# EAGLE design MessVerstaerker (EAGLE 6.2)
Messverstärker mit 4 Stufen 20, 0, -20, -40 dB
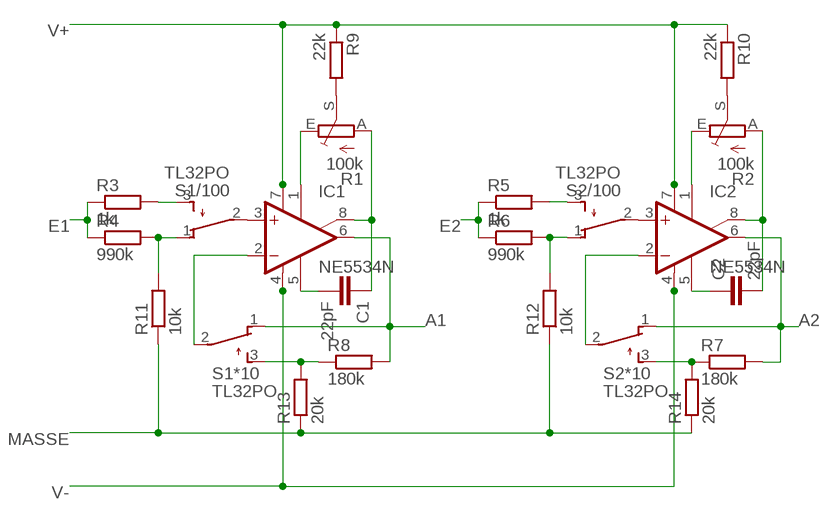
[diagram p0: schematic, sheet 1]

## Parts
C1  22pF  C2.5/2  [C2.5-2]
C2  22pF  C2.5/2  [C2.5-2]
IC1  NE5534N  [DIL08]
IC2  NE5534N  [DIL08]
R1  100k  TRIM_EU-B25V  [B25V]
R2  100k  TRIM_EU-B25V  [B25V]
R3  1k  R-EU_0309/10  [0309/10]
R4  990k  R-EU_0309/10  [0309/10]
R5  1k  R-EU_0309/10  [0309/10]
R6  990k  R-EU_0309/10  [0309/10]
R7  180k  R-EU_0309/10  [0309/10]
R8  180k  R-EU_0309/10  [0309/10]
R9  22k  R-EU_0309/10  [0309/10]
R10  22k  R-EU_0309/10  [0309/10]
R11  10k  R-EU_0309/10  [0309/10]
R12  10k  R-EU_0309/10  [0309/10]
R13  20k  R-EU_0309/10  [0309/10]
R14  20k  R-EU_0309/10  [0309/10]
S1*10  TL32PO  [TL3XPO]
S1/100  TL32PO  [TL3XPO]
S2*10  TL32PO  [TL3XPO]
S2/100  TL32PO  [TL3XPO]

## Nets
A1: IC1.6(OUT) R8.2 S1*10.1(O)
A2: IC2.6(OUT) R7.2 S2*10.1(O)
E1: R3.1 R4.1
E2: R5.1 R6.1
MASSE: R11.1 R12.1 R13.1 R14.1
N$1: R1.S R9.2
N$2: R2.S R10.2
N$3: IC2.1(ON) R2.E
N$4: C1.2 IC1.5(CMP)
N$5: C2.2 IC2.8(ON/CMP) R2.A
N$6: C1.1 IC1.8(ON/CMP) R1.A
N$7: IC1.1(ON) R1.E
N$8: C2.1 IC2.5(CMP)
N$10: R6.2 R12.2 S2/100.1(O)
N$11: R4.2 R11.2 S1/100.1(O)
N$12: IC1.3(+IN) S1/100.2(P)
N$13: R8.1 R13.2 S1*10.3(S)
N$14: R3.2 S1/100.3(S)
N$15: IC2.3(+IN) S2/100.2(P)
N$16: R7.1 R14.2 S2*10.3(S)
N$17: IC1.2(-IN) S1*10.2(P)
N$18: IC2.2(-IN) S2*10.2(P)
N$19: R5.2 S2/100.3(S)
V+: IC1.7(V+) IC2.7(V+) R9.1 R10.1
V-: IC1.4(V-) IC2.4(V-)

## Library data of the parts
C1 C2 = capacitor-wima:C: CAPACITOR naming: grid - package width
IC1 IC2 = linear:NE5534: LOW-NOISE OPERATIONAL AMPLIFIER Source: http://focus.ti.com/lit/ds/symlink/ne5534.pdf
R1 R2 = pot:TRIM_EU-: POTENTIOMETER
R3-R14 = resistor:R-EU_: RESISTOR, European symbol
S1*10 S1/100 S2*10 S2/100 = switch:TL32PO: TINY SWITCH ON - MOM Source: http://www2.produktinfo.conrad.com/datenblaetter/700000-724999/705152-da-01-de-Subminiaturschalter_TL_36YO.pdf

## Board
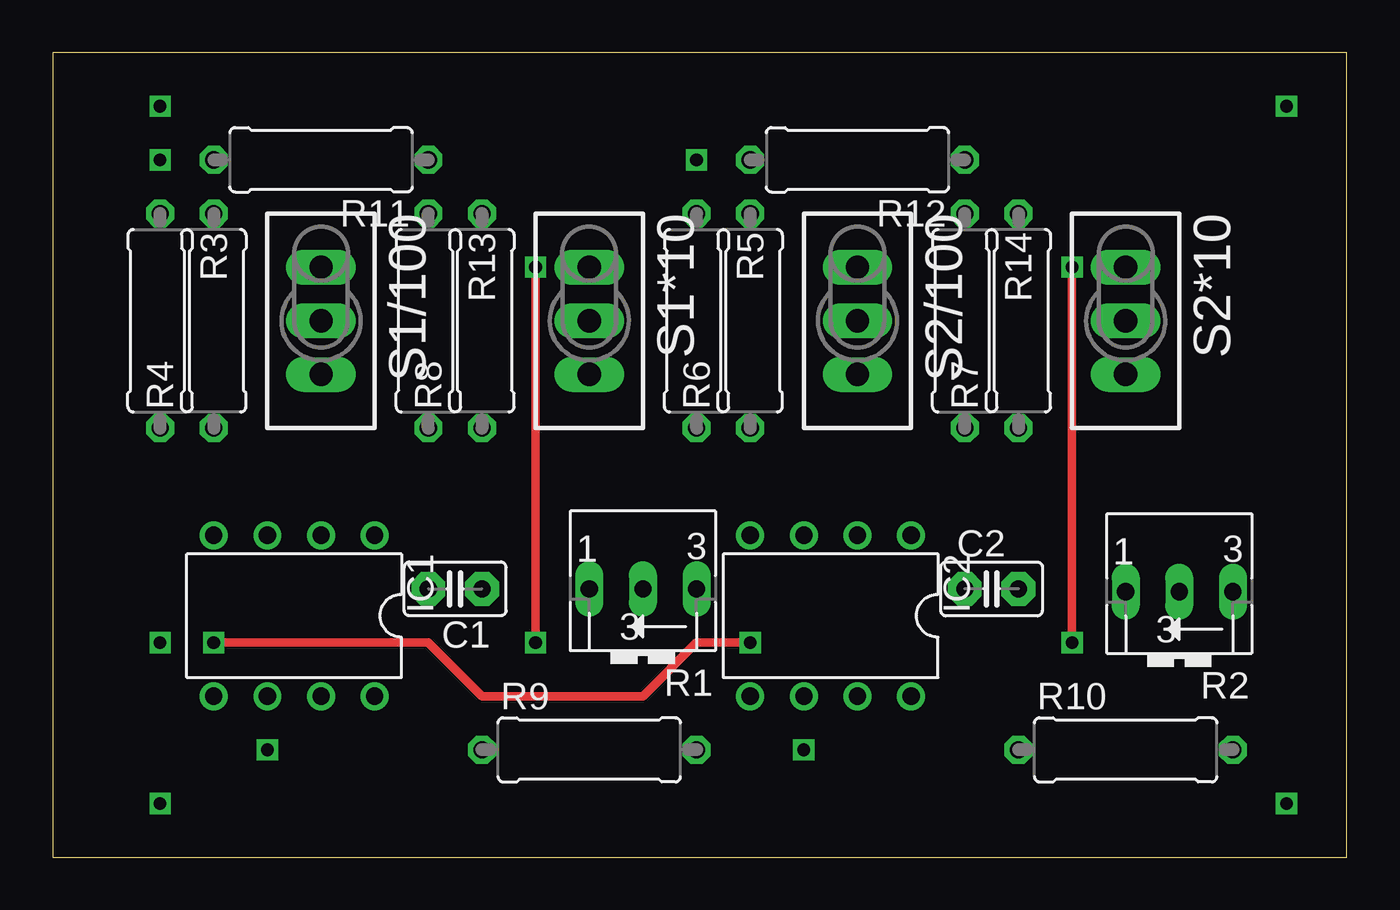
[diagram p1: board, top side]
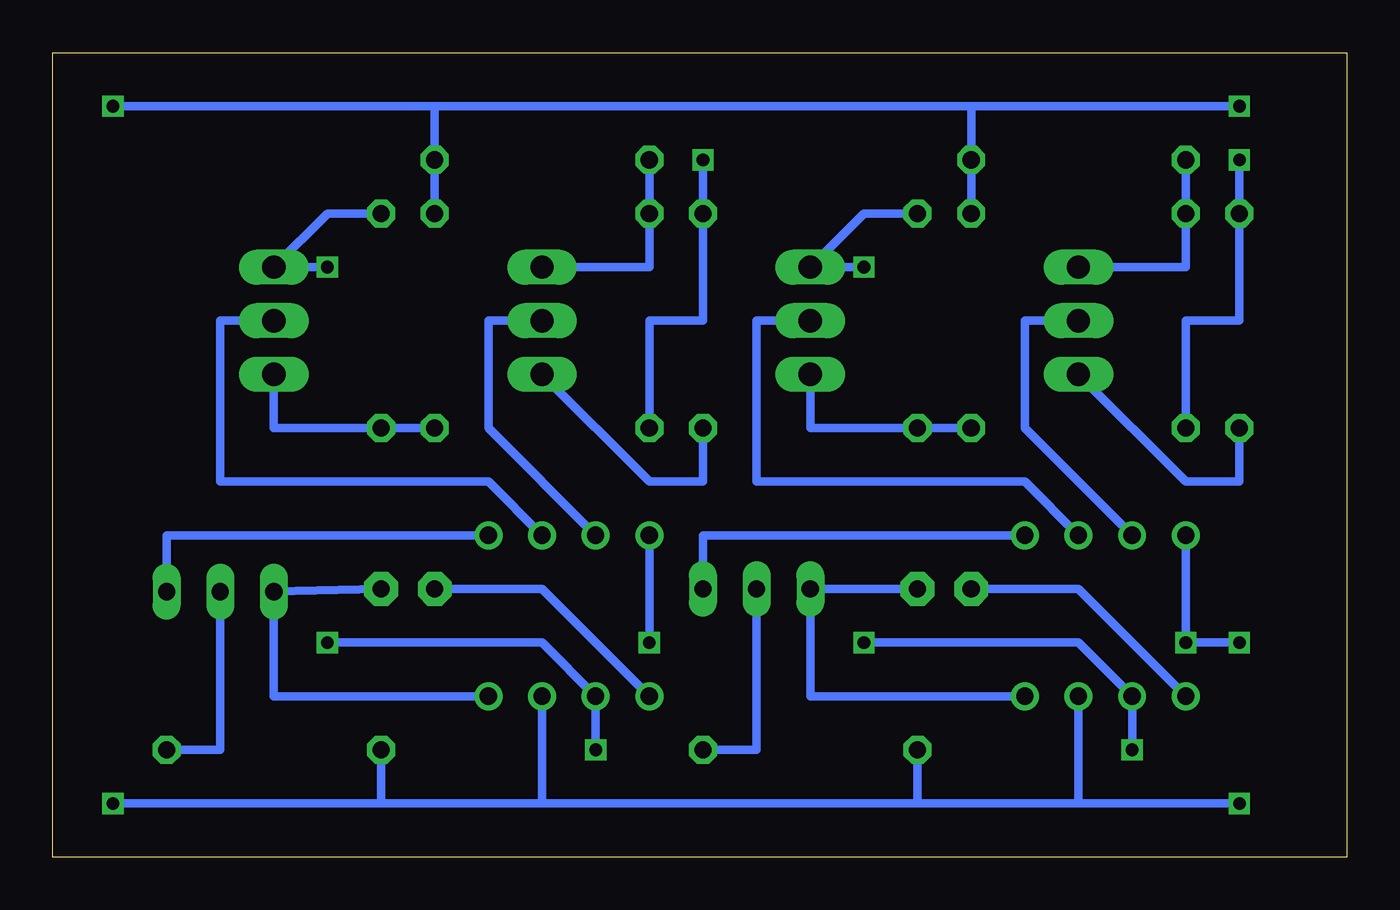
[diagram p2: board, bottom side, seen from below]

Size 61.27 x 38.09 mm. Coordinates in mm from the lower left corner, seen from the top.
Outline: 0,0 61.27,0 61.27,38.09 0,38.09 0,0
Copper layers (1*16): Top 0.035mm / dielectric 1.5mm / Bottom 0.035mm
Design rules "default": minimum track width 10mil, minimum drill 24mil, track to track 8mil, track to pad 8mil, pad to pad 8mil, via to via 8mil, smd to smd 8mil, copper to edge 40mil, drill to drill 8mil, minimum pad ring 10mil, minimum via ring 8mil, stop-mask expansion 4mil, vias tented up to drill 0mil, thermal gap 10mil

### Footprints (pad centres in the part's own frame; a part is rotated, then mirrored left to right if it is on the bottom)
C2.5-2 = drill 0.813 pad 1.6 octagon: 1 -1.27,0; 2 1.27,0
DIL08 = drill 0.813 pad 1.27 round: 1 -3.81,-3.81; 2 -1.27,-3.81; 3 1.27,-3.81; 4 3.81,-3.81; 5 3.81,3.81; 6 1.27,3.81; 7 -1.27,3.81; 8 -3.81,3.81
B25V = drill 0.813 long: A 2.54,0.635; E -2.54,0.635; S 0,0.635
0309/10 = drill 0.813 octagon: 1 -5.08,0; 2 5.08,0
TL3XPO = drill 1.1 pad 1.422 long: 1 -2.54,0; 2 0,0; 3 2.54,0

### Placement (x,y rotation side)
C1  19.05,12.7 180 top
C2  44.45,12.7 0 top
IC1  11.43,11.43 180 top
IC2  36.83,11.43 180 top
R1  27.94,13.34 180 top
R2  53.34,13.21 180 top
R3  5.08,25.4 270 top
R4  7.62,25.4 90 top
R5  30.48,25.4 270 top
R6  33.02,25.4 90 top
R7  45.72,25.4 90 top
R8  20.32,25.4 90 top
R9  25.4,5.08 0 top
R10  50.8,5.08 0 top
R11  12.7,33.02 180 top
R12  38.1,33.02 180 top
R13  17.78,25.4 270 top
R14  43.18,25.4 270 top
S1*10  25.4,25.4 270 top
S1/100  12.7,25.4 270 top
S2*10  50.8,25.4 270 top
S2/100  38.1,25.4 270 top

### Tracks (layer width: path | path; a pad name or v marks a point on that pad's centre or on a via)
A1  (via drill 0.6)
  Top 0.406: v22.86,27.94 v22.86,10.16
  Bottom 0.406: R8.2 22.86,30.48 S1*10.1 v22.86,27.94 | v22.86,10.16 12.7,10.16 IC1.6 v10.16,5.08
A2  (via drill 0.6)
  Top 0.406: v48.26,27.94 v48.26,10.16
  Bottom 0.406: R7.2 48.26,30.48 S2*10.1 v48.26,27.94 | v48.26,10.16 38.1,10.16 IC2.6 v35.56,5.08
E1  (via drill 0.6)
  Bottom 0.406: R4.1 7.62,25.4 5.08,25.4 R3.1 v5.08,33.02
E2  (via drill 0.6)
  Bottom 0.406: R6.1 33.02,25.4 30.48,25.4 R5.1 v30.48,33.02
MASSE  (via drill 0.6)
  Bottom 0.406: R13.1 R11.1 17.78,35.56 | 17.78,35.56 43.18,35.56 | 43.18,35.56 R12.1 R14.1 | 17.78,35.56 v5.08,35.56 | 43.18,35.56 v58.42,35.56
N$1
  Bottom 0.406: R9.2 27.94,5.08 R1.S
N$2
  Bottom 0.406: R10.2 53.34,5.08 R2.S
N$3
  Bottom 0.406: IC2.1 55.88,15.24 R2.E
N$4
  Bottom 0.406: IC1.5 12.7,12.7 C1.2
N$5
  Bottom 0.406: IC2.8 50.8,7.62 R2.A C2.2
N$6
  Bottom 0.406: IC1.8 25.4,7.62 R1.A C1.1
N$7
  Bottom 0.406: IC1.1 30.48,15.24 R1.E
N$8
  Bottom 0.406: IC2.5 38.1,12.7 C2.1
N$10
  Bottom 0.406: R12.2 R6.2 33.02,27.94 S2/100.1
N$11
  Bottom 0.406: S1/100.1 7.62,27.94 R4.2 R11.2
N$12
  Bottom 0.406: S1/100.2 15.24,25.4 15.24,20.32 IC1.3
N$13
  Bottom 0.406: S1*10.3 25.4,20.32 R8.1 R13.2
N$14
  Bottom 0.406: R3.2 5.08,17.78 7.62,17.78 S1/100.3
N$15
  Bottom 0.406: S2/100.2 40.64,25.4 40.64,20.32 IC2.3
N$16
  Bottom 0.406: S2*10.3 50.8,20.32 R7.1 R14.2
N$17
  Bottom 0.406: IC1.2 15.24,17.78 27.94,17.78 27.94,25.4 S1*10.2
N$18
  Bottom 0.406: S2*10.2 53.34,25.4 53.34,17.78 40.64,17.78 IC2.2
N$19
  Bottom 0.406: R5.2 30.48,17.78 33.02,17.78 S2/100.3
V+  (via drill 0.6)
  Bottom 0.406: 20.32,2.54 R9.1 | 20.32,2.54 38.1,2.54 | 38.1,2.54 45.72,2.54 | 45.72,2.54 R10.1 | 12.7,2.54 IC1.7 | 12.7,2.54 20.32,2.54 | 38.1,2.54 IC2.7 | 12.7,2.54 v5.08,2.54 | 45.72,2.54 v58.42,2.54
V-  (via drill 0.6)
  Top 0.406: v7.62,10.16 17.78,10.16 20.32,7.62 27.94,7.62 30.48,10.16 v33.02,10.16
  Bottom 0.406: IC1.4 v7.62,10.16 v5.08,10.16 | IC2.4 v33.02,10.16